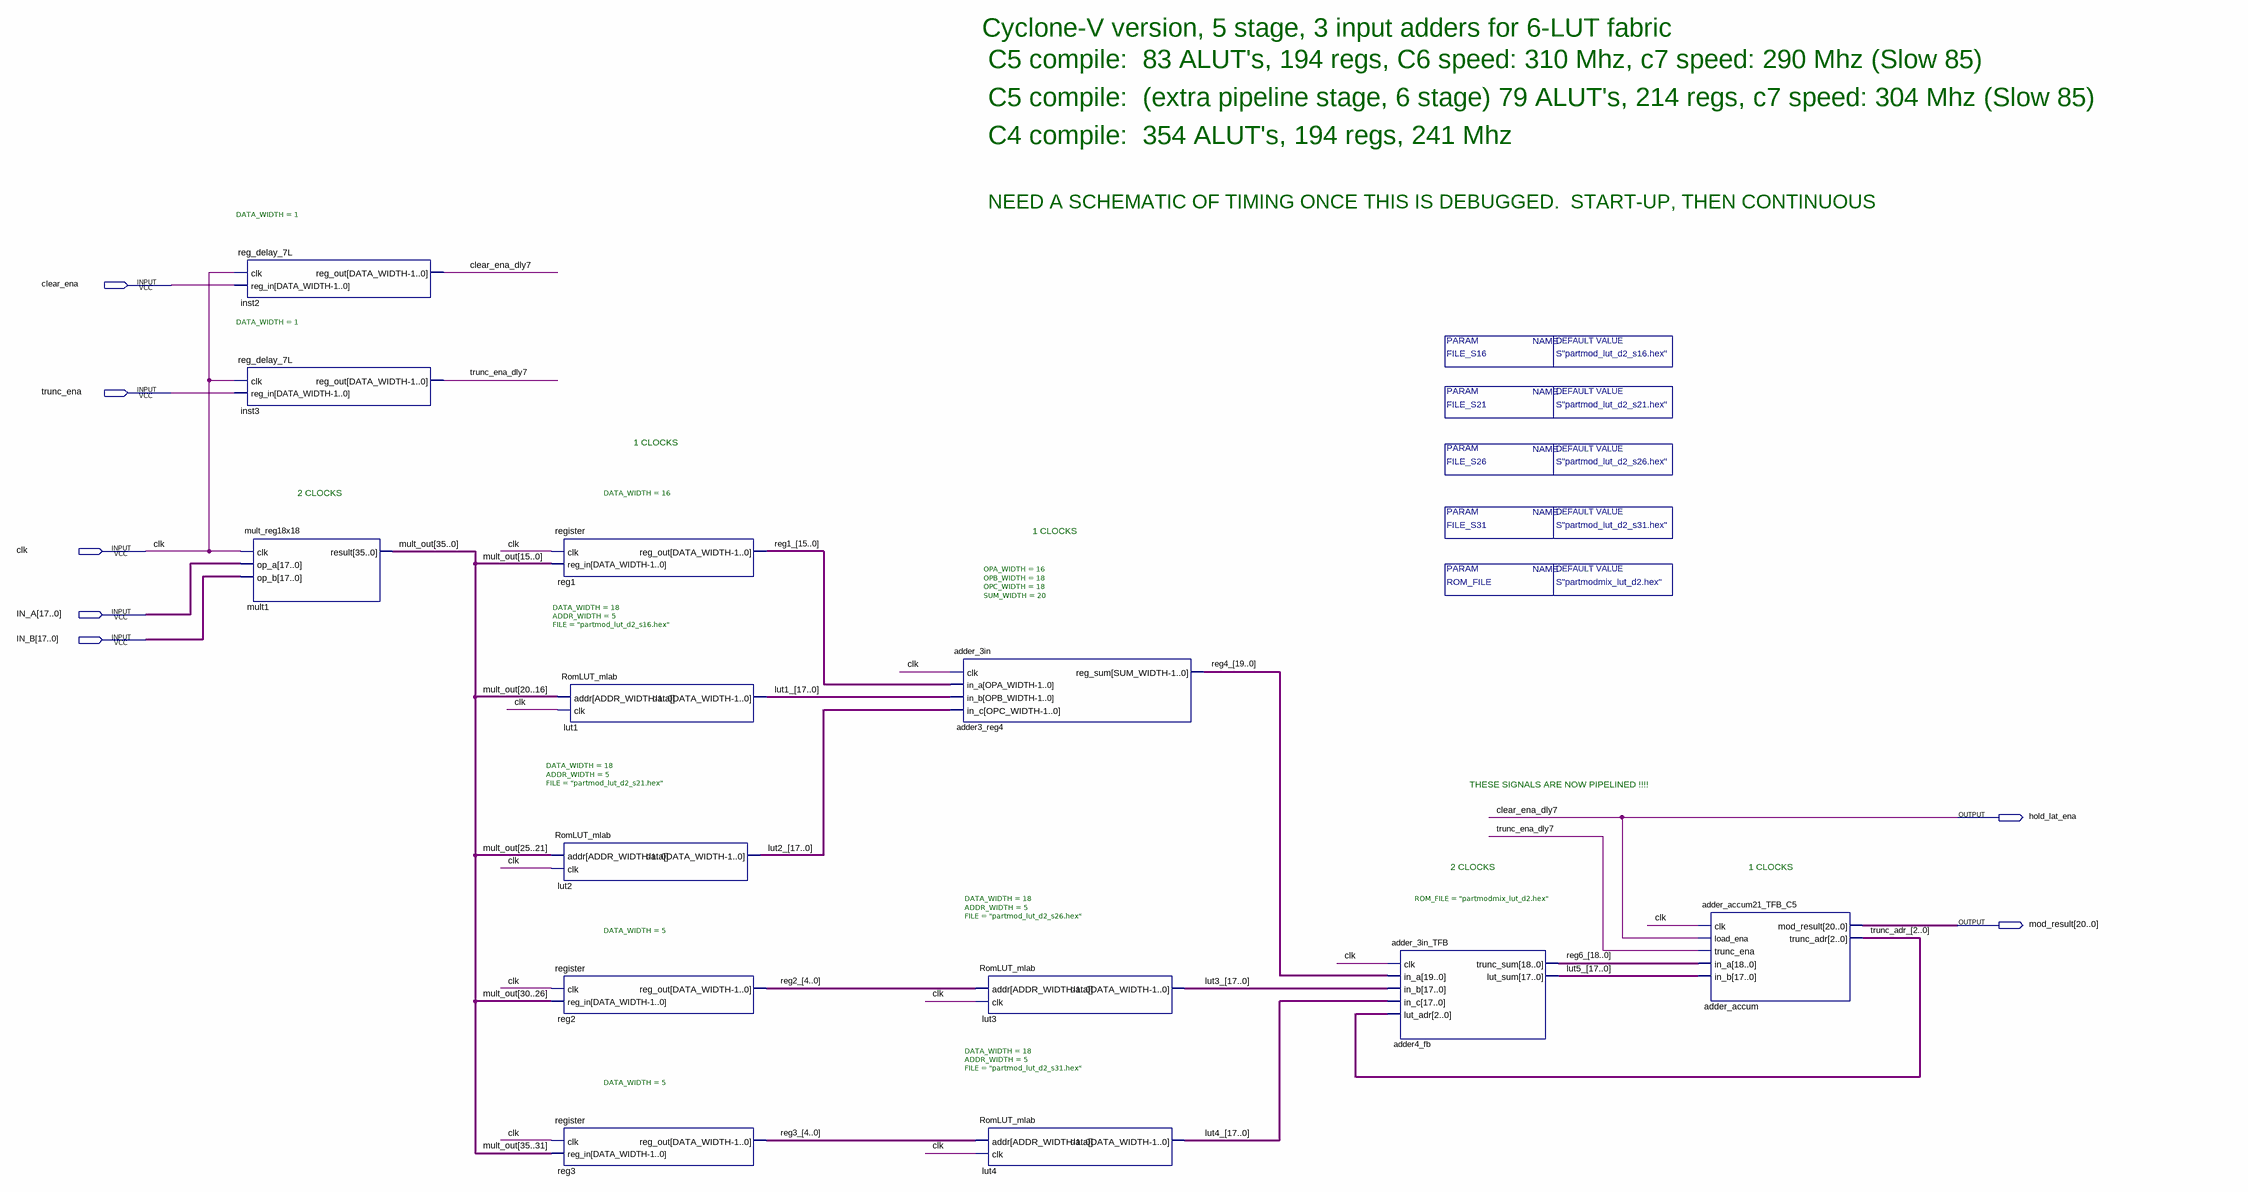
[diagram p0: schematic sheet]
// Quartus schematic ModMultAccumTFB_7L_18x21.bdf as structural Verilog: 13 symbols, 7 pins
module ModMultAccumTFB_7L_18x21 #(parameter FILE_S16 = "S\"partmod_lut_d2_s16.hex\"", parameter FILE_S21 = "S\"partmod_lut_d2_s21.hex\"", parameter FILE_S26 = "S\"partmod_lut_d2_s26.hex\"", parameter FILE_S31 = "S\"partmod_lut_d2_s31.hex\"", parameter ROM_FILE = "S\"partmodmix_lut_d2.hex\"") (
  input  clear_ena,
  input  trunc_ena,
  input  clk,
  input  [17:0] IN_A,
  input  [17:0] IN_B,
  output hold_lat_ena,
  output [20:0] mod_result
);

  wire trunc_ena_dly7;
  wire [2:0] trunc_adr_;
  wire [4:0] reg2_, reg3_;
  wire [15:0] reg1_;
  wire [17:0] lut1_, lut2_, lut3_, lut4_, lut5_;
  wire [18:0] reg6_;
  wire [19:0] reg4_;
  wire [35:0] mult_out;

  reg_delay_7L #(.DATA_WIDTH(1)) inst2 (.clk(clk), .reg_in(clear_ena), .reg_out(hold_lat_ena));
  reg_delay_7L #(.DATA_WIDTH(1)) inst3 (.clk(clk), .reg_in(trunc_ena), .reg_out(trunc_ena_dly7));
  mult_reg18x18 mult1 (.clk(clk), .op_a(IN_A), .op_b(IN_B), .result(mult_out));
  register #(.DATA_WIDTH(16)) reg1 (.clk(clk), .reg_in(mult_out[15:0]), .reg_out(reg1_));
  RomLUT_mlab #(.DATA_WIDTH(18), .ADDR_WIDTH(5), .FILE("partmod_lut_d2_s16.hex")) lut1 (
    .addr(mult_out[20:16]), .clk(clk), .data(lut1_));
  RomLUT_mlab #(.DATA_WIDTH(18), .ADDR_WIDTH(5), .FILE("partmod_lut_d2_s21.hex")) lut2 (
    .addr(mult_out[25:21]), .clk(clk), .data(lut2_));
  register #(.DATA_WIDTH(5)) reg2 (.clk(clk), .reg_in(mult_out[30:26]), .reg_out(reg2_));
  register #(.DATA_WIDTH(5)) reg3 (.clk(clk), .reg_in(mult_out[35:31]), .reg_out(reg3_));
  adder_3in #(.OPA_WIDTH(16), .OPB_WIDTH(18), .OPC_WIDTH(18), .SUM_WIDTH(20)) adder3_reg4 (
    .clk(clk), .in_a(reg1_), .in_b(lut1_), .in_c(lut2_), .reg_sum(reg4_));
  RomLUT_mlab #(.DATA_WIDTH(18), .ADDR_WIDTH(5), .FILE("partmod_lut_d2_s26.hex")) lut3 (
    .addr(reg2_), .clk(clk), .data(lut3_));
  RomLUT_mlab #(.DATA_WIDTH(18), .ADDR_WIDTH(5), .FILE("partmod_lut_d2_s31.hex")) lut4 (
    .addr(reg3_), .clk(clk), .data(lut4_));
  adder_3in_TFB #(.ROM_FILE("partmodmix_lut_d2.hex")) adder4_fb (
    .clk(clk), .in_a(reg4_), .in_b(lut3_), .in_c(lut4_), .lut_adr(trunc_adr_), .trunc_sum(reg6_),
    .lut_sum(lut5_));
  adder_accum21_TFB_C5 adder_accum (
    .clk(clk), .load_ena(hold_lat_ena), .trunc_ena(trunc_ena_dly7), .in_a(reg6_), .in_b(lut5_),
    .trunc_adr(trunc_adr_), .mod_result(mod_result));

  // Other names for the same wires on the sheet: clear_ena_dly7 = hold_lat_ena

  // Notes on the sheet:
  //   Cyclone-V version, 5 stage, 3 input adders for 6-LUT fabric
  //   C5 compile:  83 ALUT's, 194 regs, C6 speed: 310 Mhz, c7 speed: 290 Mhz (Slow 85)
  //   C5 compile:  (extra pipeline stage, 6 stage) 79 ALUT's, 214 regs, c7 speed: 304 Mhz (Slow 85)
  //   C4 compile:  354 ALUT's, 194 regs, 241 Mhz
  //   NEED A SCHEMATIC OF TIMING ONCE THIS IS DEBUGGED.  START-UP, THEN CONTINUOUS
  //   1 CLOCKS
  //   2 CLOCKS
  //   1 CLOCKS
  //   THESE SIGNALS ARE NOW PIPELINED !!!!
  //   2 CLOCKS
  //   1 CLOCKS
endmodule
